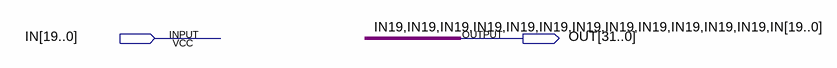
[diagram p0: schematic sheet]
// Quartus schematic ext20_32.bdf as structural Verilog: 0 symbols, 2 pins
module ext20_32 (
  input  [19:0] IN,
  output [31:0] OUT
);


  assign OUT = {{13{IN[19]}}, IN[18:0]};
endmodule
